# EAGLE design chessexpress (EAGLE 9.5.1)
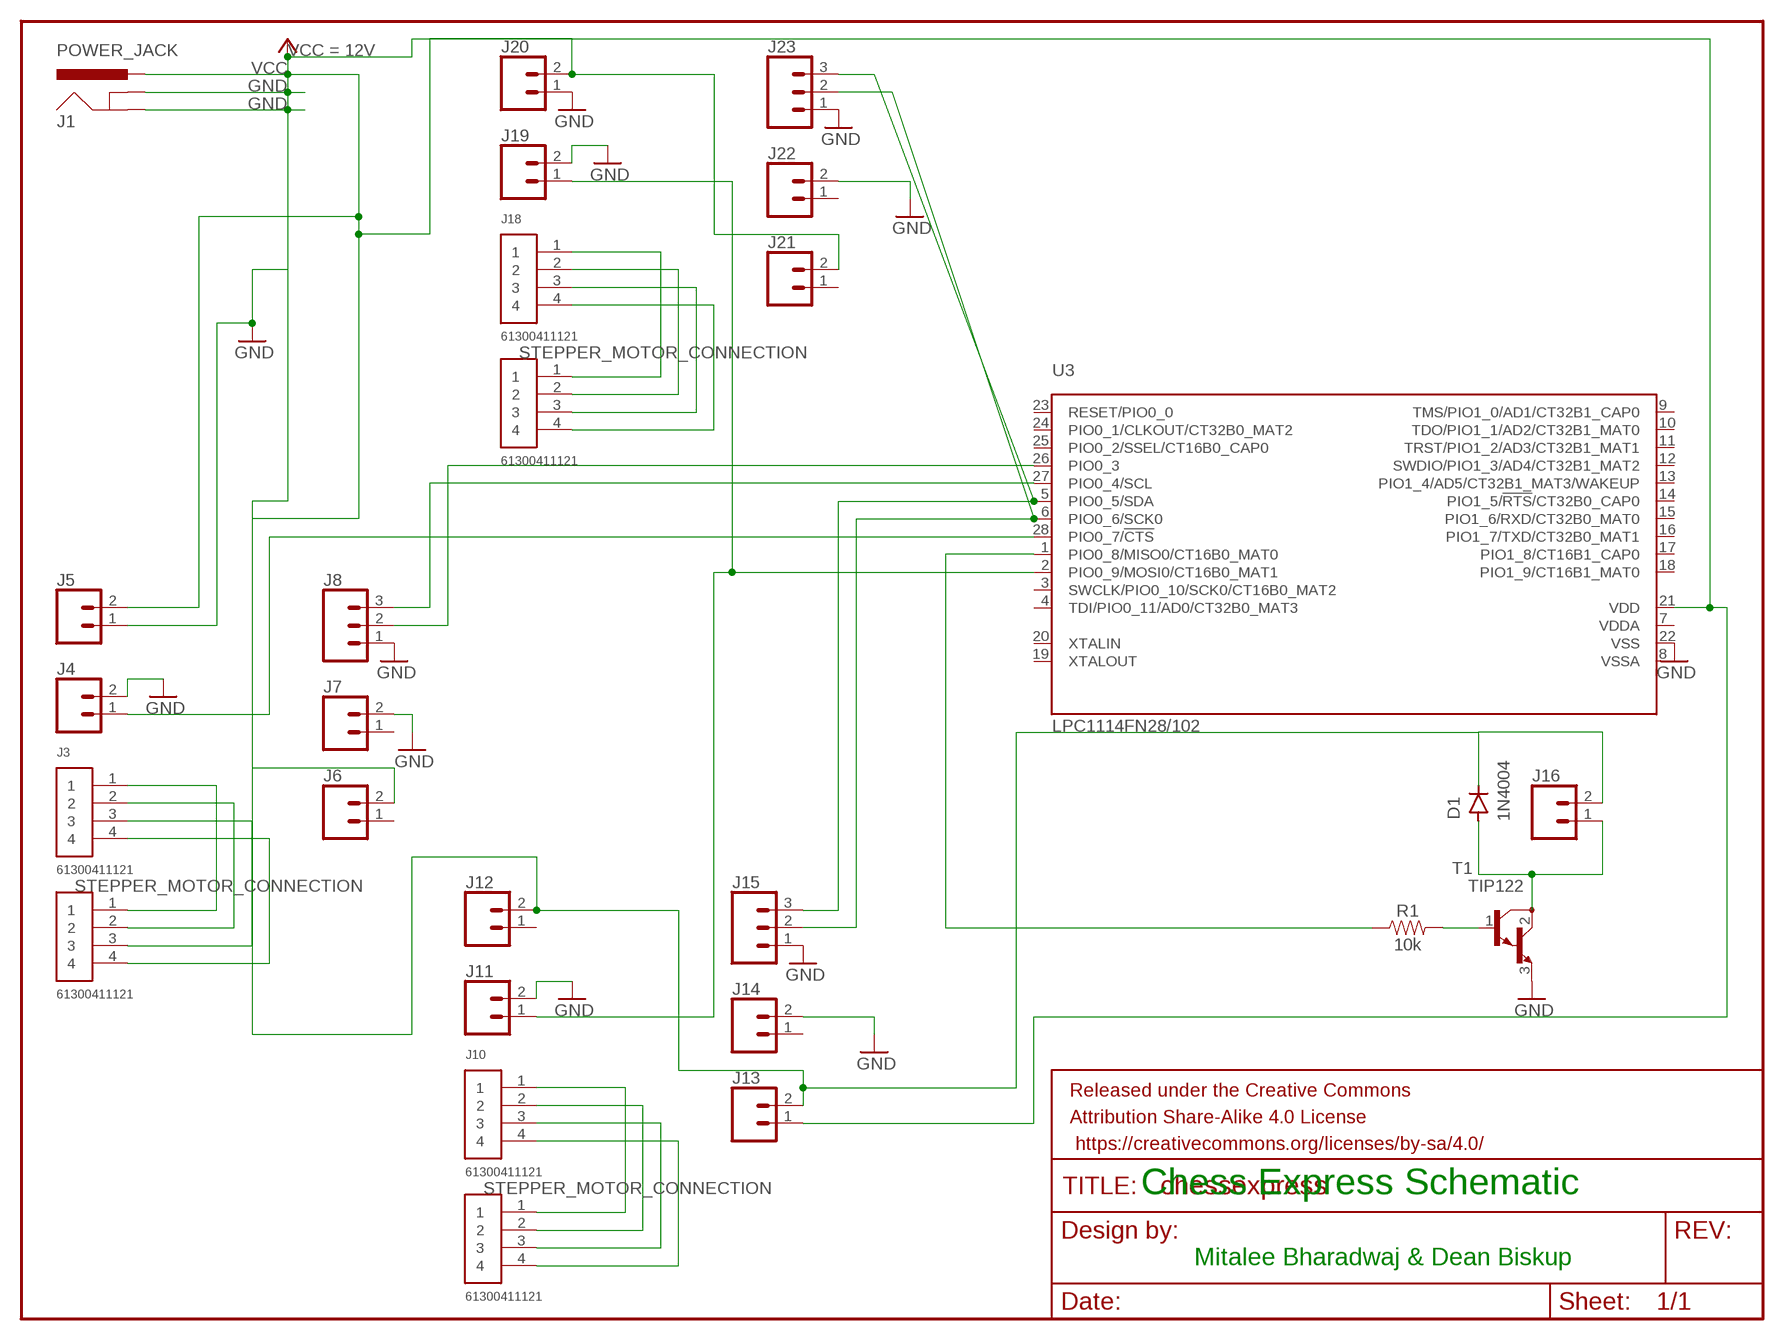
[diagram p0: schematic, sheet 1]

## Parts
D1  1N4004  [DO-41]
FRAME  FRAME-LETTERNO_PACKAGE  [DUMMY]
J1  POWER_JACK  [POWER_JACK_PTH]
J2  61300411121  [61300411121]
J3  61300411121  [61300411121]
J4  CONN_02  [1X02]
J5  CONN_02  [1X02]
J6  CONN_02  [1X02]
J7  CONN_02  [1X02]
J8  CONN_03  [1X03]
J9  61300411121  [61300411121]
J10  61300411121  [61300411121]
J11  CONN_02  [1X02]
J12  CONN_02  [1X02]
J13  CONN_02  [1X02]
J14  CONN_02  [1X02]
J15  CONN_03  [1X03]
J16  CONN_02  [1X02]
J17  61300411121  [61300411121]
J18  61300411121  [61300411121]
J19  CONN_02  [1X02]
J20  CONN_02  [1X02]
J21  CONN_02  [1X02]
J22  CONN_02  [1X02]
J23  CONN_03  [1X03]
R1  10k  10KOHM-0603-1/10W-1%  [0603]
T1  TIP122  [TO220]
U3  LPC1114FN28/102  [SOT117]

## Nets
GND: J1.GND J1.GNDBREAK J4.2 J5.1 J7.2 J8.1 J11.2 J14.2 J15.1 J19.2 J20.1 J22.2 J23.1 T1.3(E) U3.22(VSS)
J2_1: J2.1 J3.1
J2_2: J2.2 J3.2
J2_3: J2.3 J3.3
J2_4: J2.4 J3.4
J2_5: J9.1 J10.1
J2_6: J9.2 J10.2
J2_7: J9.3 J10.3
J2_8: J9.4 J10.4
J2_9: J17.1 J18.1
J2_10: J17.2 J18.2
J2_11: J17.3 J18.3
J2_12: J17.4 J18.4
N$1: J4.1 U3.28(PIO0_7/!CTS!)
N$2: D1.A J16.1 T1.2(C)
N$3: J11.1 J19.1 U3.2(PIO0_9/MOSI0/CT16B0_MAT1)
N$4: J8.3 U3.27(PIO0_4/SCL)
N$5: J8.2 U3.26(PIO0_3)
N$8: R1.1 U3.1(PIO0_8/MISO0/CT16B0_MAT0)
N$9: R1.2 T1.1(B)
N$10: J15.3 J23.3 U3.5(PIO0_5/SDA)
N$11: J15.2 J23.2 U3.6(PIO0_6/SCK0)
VCC: D1.C J1.PWR J5.2 J6.2 J12.2 J13.1 J13.2 J16.2 J20.2 J21.2 U3.21(VDD)
Unconnected: J6.1 J7.1 J12.1 J14.1 J21.1 J22.1 U3.3(SWCLK/PIO0_10/SCK0/CT16B0_MAT2) U3.4(TDI/PIO0_11/AD0/CT32B0_MAT3) U3.9(TMS/PIO1_0/AD1/CT32B1_CAP0) U3.10(TDO/PIO1_1/AD2/CT32B1_MAT0) U3.11(TRST/PIO1_2/AD3/CT32B1_MAT1) U3.12(SWDIO/PIO1_3/AD4/CT32B1_MAT2) U3.13(PIO1_4/AD5/CT32B1_MAT3/WAKEUP) U3.14(PIO1_5/!RTS!/CT32B0_CAP0) U3.15(PIO1_6/RXD/CT32B0_MAT0) U3.16(PIO1_7/TXD/CT32B0_MAT1) U3.17(PIO1_8/CT16B1_CAP0) U3.18(PIO1_9/CT16B1_MAT0) U3.19(XTALOUT) U3.20(XTALIN) U3.23(RESET/PIO0_0) U3.24(PIO0_1/CLKOUT/CT32B0_MAT2) U3.25(PIO0_2/SSEL/CT16B0_CAP0)

## Notes on the sheet
- Chess Express Schematic
- Mitalee Bharadwaj & Dean Biskup

## Power pins joined to a net without a drawn wire
VDDA: U3.7(VDDA)
VSSA: U3.8(VSSA)

## Library data of the parts
D1 = Diodes:1N4004: DIODE GEN PURP 400V 1A DO41 Manufacturer's datasheet <https://www.mccsemi.com/pdf/Products/1N4001-1N4007(DO-41).pdf>; CREATED_BY: PCBLayout.com; DIGIKEY_PART_NUMBER: 1N4004MSCT-ND; MANUFACTURER: Micro Commercial Co; MPN: 1N4004; PACKAGE: DO-41
FRAME = SparkFun-Aesthetics:FRAME-LETTER: Schematic Frame - Letter Standard 8.5x11 US Letter frame; DESIGNER: Nobody; VERSION: v01
J1 = SparkFun-Connectors:POWER_JACK: Power Jack Connector This is the standard 5.5mm barrel jack for power. The PTH is the most common, proven, reliable, footprint. The Slot footprint only works if the mill layer is transmitted to the PCB fab house so be warned. Here are the connectors we sell at SparkFun: DC Barrel Power Jack/Connector <https://www.sparkfun.com/products/119> (PRT-00119) DC Barrel Power Jack/Connector (SMD) <https://www.sparkfun.com/products/12748> (PRT-12748) DC Barrel Jack Adapter - Breadboard Compatible <https://www.sparkfun.com/products/10811> (PRT-10811) It is used on this SparkFun product (and many, many others): SparkFun RedBoard - Programmed with Arduino <https://www.sparkfun.com/products/12757> (DEV-12757) Also, if you need a mating power supply or connector, please check these out: Wall Adapter Power Supply - 9VDC 650mA <https://www.sparkfun.com/products/298> (TOL-00298) DC Barrel Jack Adapter - Male <https://www.sparkfun.com/products/10287> (PRT-10287); PROD_ID: CONN-08197
J2 J9 J17 = Headers:61300411121: CONN HEADER VERT 4POS 2.54MM Manufacturer's datasheet <https://katalog.we-online.de/em/datasheet/6130xx11121.pdf>; CREATED_BY: PCBLayout.com; DIGI_KEY_PART_NUMBER: 732-5317-ND; FEMALE_HEADER: STEPPER_MOTOR_CONNECTION; MANUFACTURER: Wurth Electronics Inc.; MPN: 61300411121
J3 J10 J18 = Headers:61300411121: CONN HEADER VERT 4POS 2.54MM Manufacturer's datasheet <https://katalog.we-online.de/em/datasheet/6130xx11121.pdf>; CREATED_BY: PCBLayout.com; DIGI_KEY_PART_NUMBER: 732-5317-ND; MANUFACTURER: Wurth Electronics Inc.; MPN: 61300411121
J4-J7 J11-J14 J16 J19-J22 = SparkFun-Connectors:CONN_02: Multi connection point. Often used as Generic Header-pin footprint for 0.1 inch spaced/style header connections On any of the 0.1 inch spaced packages, you can populate with these: Break Away Headers - Straight <https://www.sparkfun.com/products/116> (PRT-00116) Break Away Male Headers - Right Angle <https://www.sparkfun.com/products/553> (PRT-00553) Female Headers <https://www.sparkfun.com/products/115> (PRT-00115) Break Away Headers - Machine Pin <https://www.sparkfun.com/products/117> (PRT-00117) Break Away Female Headers - Swiss Machine Pin <https://www.sparkfun.com/products/743> (PRT-00743) For SCREWTERMINALS and SPRING TERMINALS visit here: Screw Terimnals on SparkFun.com <https://www.sparkfun.com/search/results?term=Screw+Terminals> (5mm/3.5mm/2.54mm spacing) This device is also useful as a general connection point to wire up your design to another part of your project. Our various solder wires solder well into these plated through hole pads. Hook-Up Wire - Assortment (Stranded, 22 AWG) <https://www.sparkfun.com/products/11375> (PRT-11375) Hook-Up Wire - Assortment (Solid Core, 22 AWG) <https://www.sparkfun.com/products/11367> (PRT-11367) View the entire wire category on our website here <https://www.sparkfun.com/categories/141> Special notes: Molex polarized connector foot print use with: PRT-08233 with associated crimp pins and housings. 2.54_SCREWTERM for use with PRT-10571. 3.5mm Screw Terminal footprints for PRT-08084 5mm Screw Terminal footprints for use with PRT-08432
J8 J15 J23 = SparkFun-Connectors:CONN_03: Multi connection point. Often used as Generic Header-pin footprint for 0.1 inch spaced/style header connections On any of the 0.1 inch spaced packages, you can populate with these: Break Away Headers - Straight <https://www.sparkfun.com/products/116> (PRT-00116) Break Away Male Headers - Right Angle <https://www.sparkfun.com/products/553> (PRT-00553) Female Headers <https://www.sparkfun.com/products/115> (PRT-00115) Break Away Headers - Machine Pin <https://www.sparkfun.com/products/117> (PRT-00117) Break Away Female Headers - Swiss Machine Pin <https://www.sparkfun.com/products/743> (PRT-00743) Stackable Header - 3 Pin (Female, 0.1") <https://www.sparkfun.com/products/13875> (PRT-13875) For SCREWTERMINALS and SPRING TERMINALS visit here: Screw Terimnals on SparkFun.com <https://www.sparkfun.com/search/results?term=Screw+Terminals> (5mm/3.5mm/2.54mm spacing) This device is also useful as a general connection point to wire up your design to another part of your project. Our various solder wires solder well into these plated through hole pads. Hook-Up Wire - Assortment (Stranded, 22 AWG) <https://www.sparkfun.com/products/11375> (PRT-11375) Hook-Up Wire - Assortment (Solid Core, 22 AWG) <https://www.sparkfun.com/products/11367> (PRT-11367) View the entire wire category on our website here <https://www.sparkfun.com/categories/141> Special notes: Molex polarized connector foot print use with SKU : PRT-08232 with associated crimp pins and housings.
R1 = SparkFun-Resistors:10KOHM: 10kΩ resistor A resistor is a passive two-terminal electrical component that implements electrical resistance as a circuit element. Resistors act to reduce current flow, and, at the same time, act to lower voltage levels within circuits. - Wikipedia; PROD_ID: RES-00824
T1 = transistor:TIP122: NPN BIPOLAR DARLINGTON TRANSISTOR
U3 = nxp_60_1_1:LPC1114FN28: 32-bit ARM Cortex-M0 microcontroller; up to 64 kB flash and 8 kB SRAM The LPC1110/11/12/13/14/15 are a ARM Cortex-M0 based, low-cost 32-bit MCU family, designed for 8/16-bit microcontroller applications, offering performance, low power, simple instruction set and memory addressing together with reduced code size compared to existing 8/16-bit architectures. The LPC1110/11/12/13/14/15 operate at CPU frequencies of up to 50 MHz. The peripheral complement of the LPC1110/11/12/13/14/15 includes up to 64 kB of flash memory, up to 8 kB of data memory, one Fast-mode Plus I 2 C-bus interface, one RS-485/EIA-485 UART, up to two SPI interfaces with SSP features, four general purpose counter/timers, a 10-bit ADC, and up to 42 general purpose I/O pins. Remark: The LPC111x series consists of the LPC1100 series (parts LPC111x/101/201/301), LPC1100L series (parts LPC111x/002/102/202/302), and the LPC1100XL series (parts LPC111x/103/203/303/323/333). The LPC1100L and LPC1100XL series include the power profiles, a windowed watchdog timer, and a configurable open-drain mode. AAL Eindhoven MK; ADC: 6; FLASH: 32kB; GPIO: 22; PWR_PROFILES: yes; SERIES: LPC1100L; SPI: 1; SRAM: 4kB

## Board
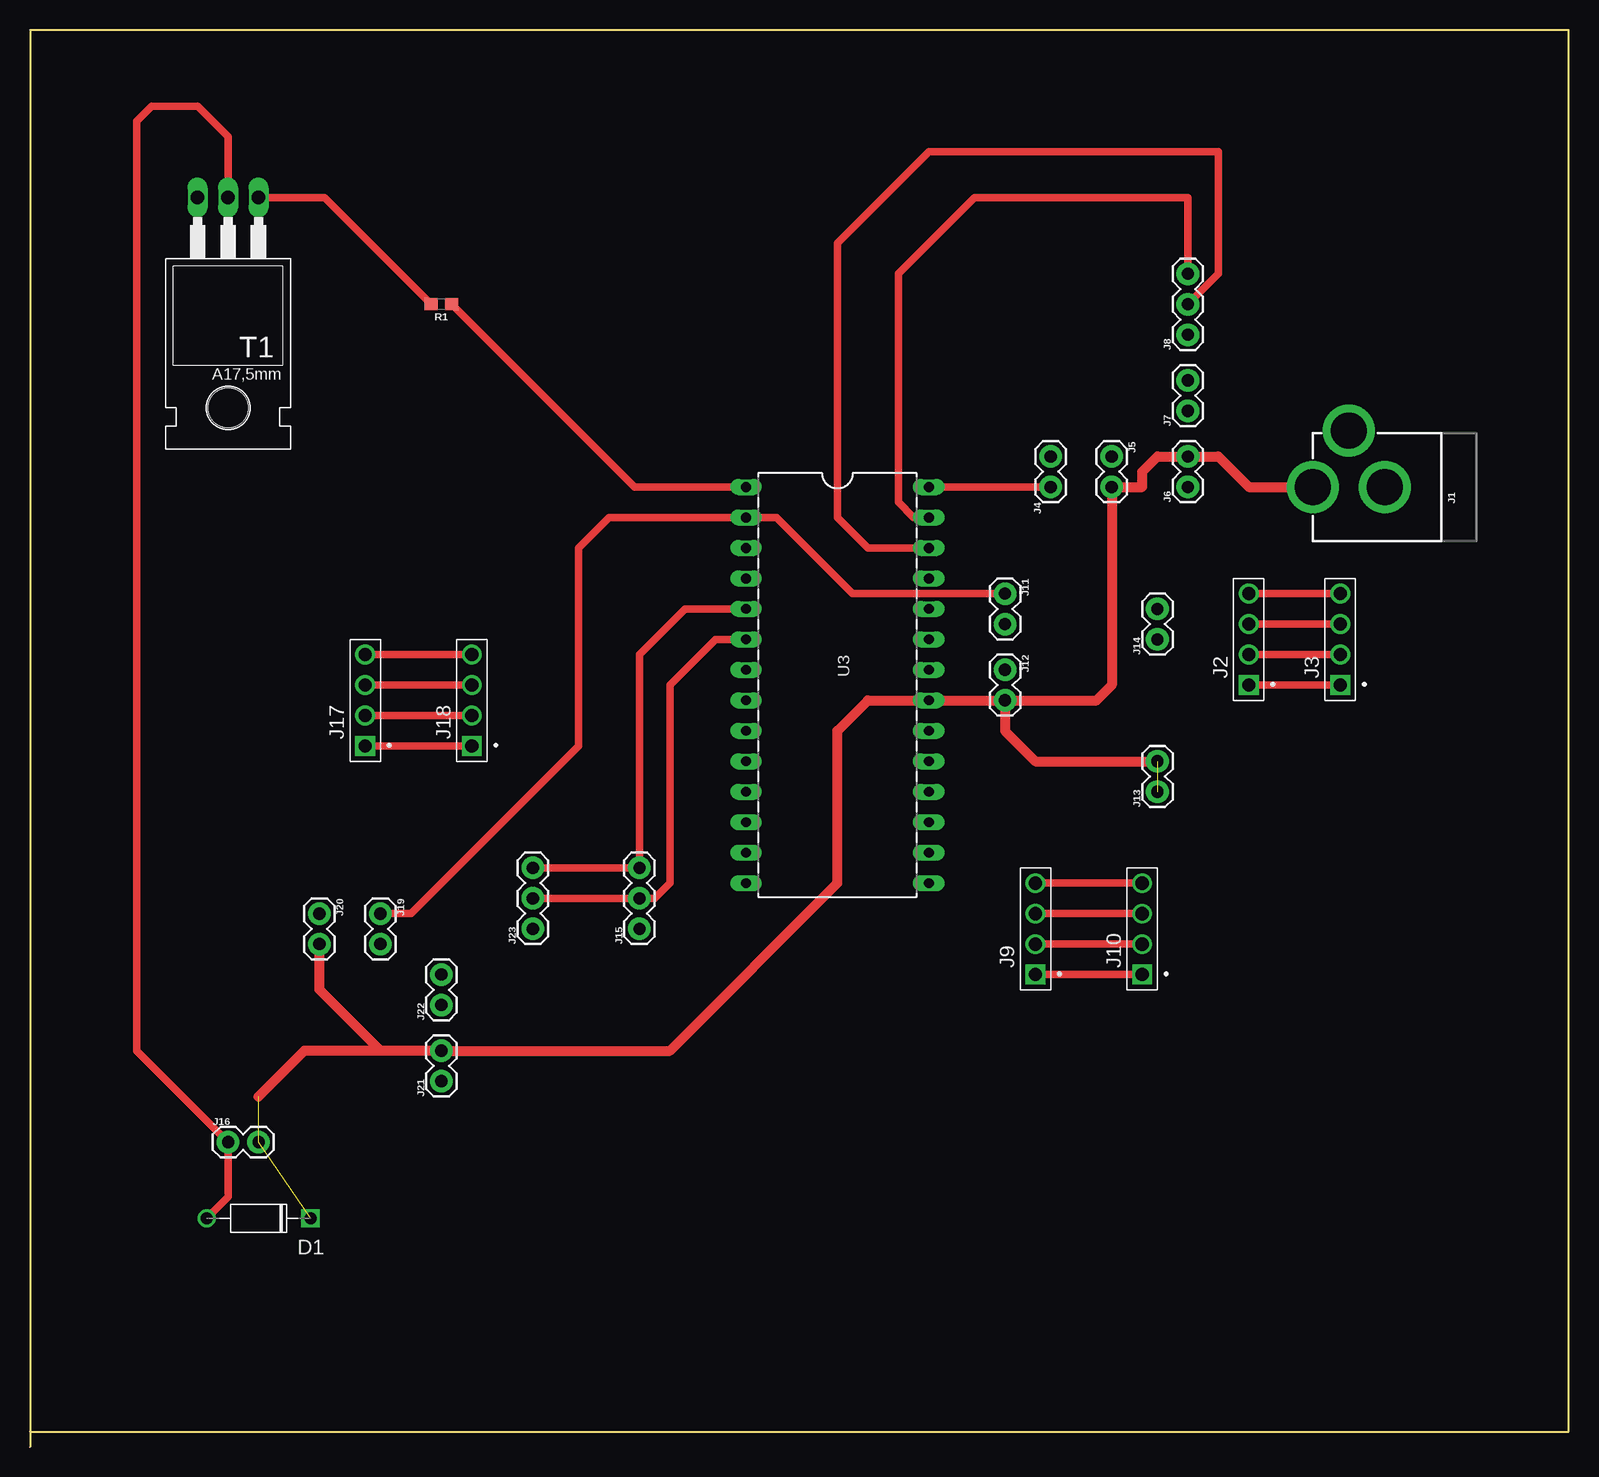
[diagram p1: board, top side]
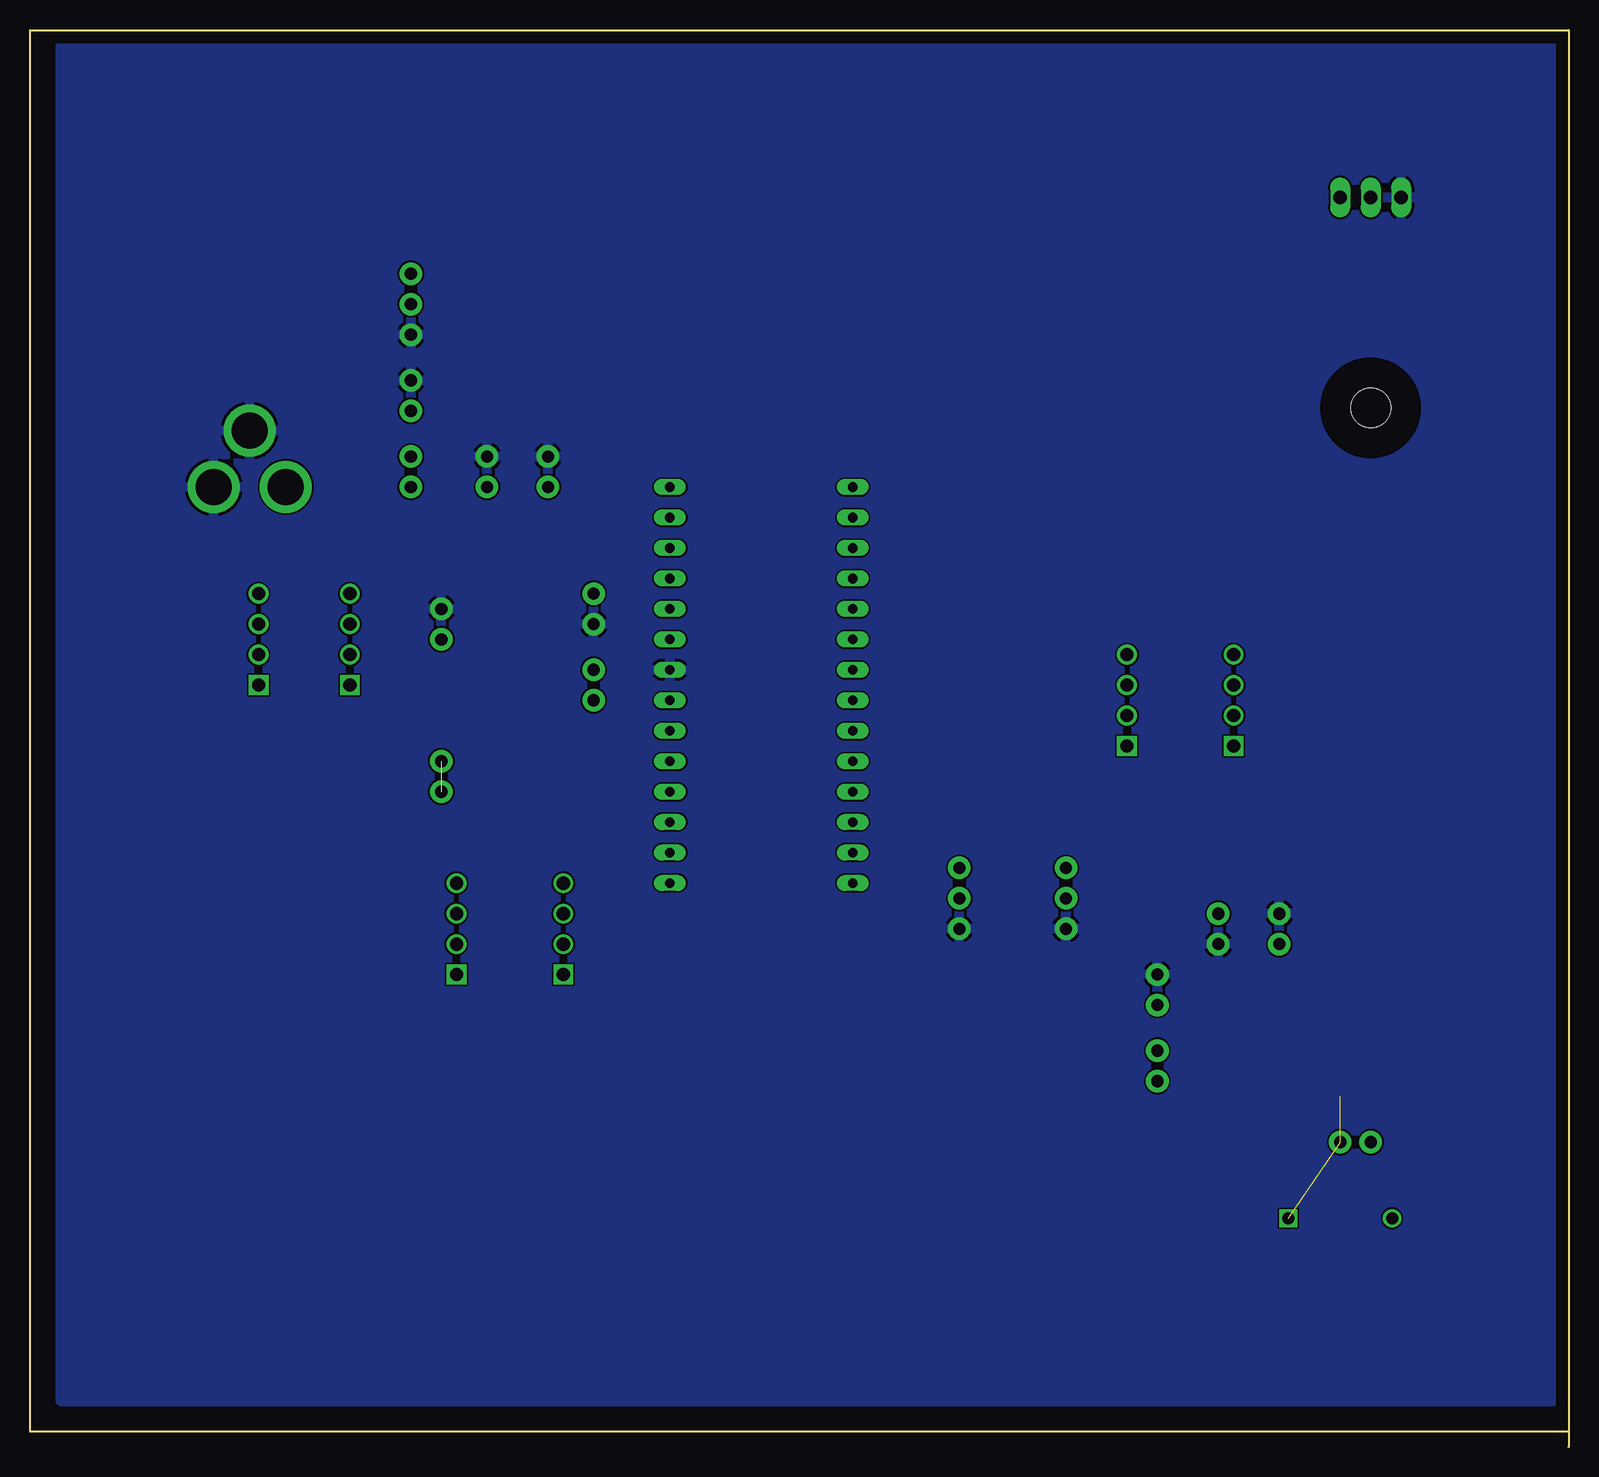
[diagram p2: board, bottom side, seen from below]

Size 128.27 x 118.11 mm. Coordinates in mm from the lower left corner, seen from the top.
Outline: 0,1.27 128.27,1.27 128.27,118.11 0,118.11 0,0
Copper layers (1*16): Top 0.035mm / dielectric 1.5mm / Bottom 0.035mm
Design rules "default": minimum track width 6mil, minimum drill 0.35mm, track to track 6mil, track to pad 6mil, pad to pad 6mil, via to via 6mil, smd to smd 6mil, copper to edge 40mil, drill to drill 6mil, minimum pad ring 10mil, minimum via ring 8mil, stop-mask expansion 4mil, vias tented up to drill 0mil, thermal gap 10mil

### Footprints (pad centres in the part's own frame; a part is rotated, then mirrored left to right if it is on the bottom)
DO-41 = drill 1: A 4.325,0 | drill 1 square: C -4.325,0
POWER_JACK_PTH = drill 2.997 pad 4.318: GND 0,7.7; GNDBREAK 4.7,10.7; PWR 0,13.7
61300411121 = drill 1.1 square: 1 -3.81,0 | drill 1.1: 2 -1.27,0; 3 1.27,0; 4 3.81,0
1X02 = drill 1.016 pad 1.88: 1 0,0; 2 2.54,0
1X03 = drill 1.016 pad 1.88: 1 0,0; 2 2.54,0; 3 5.08,0
0603 = smd 1.1 x 1: 1 -0.85,0; 2 0.85,0
TO220 = drill 1.118 long: 1 -2.54,-6.35; 2 0,-6.35; 3 2.54,-6.35 | hole 3.302: 0,11.176
SOT117 = drill 0.813 long: 1 -16.51,-7.62; 2 -13.97,-7.62; 3 -11.43,-7.62; 4 -8.89,-7.62; 5 -6.35,-7.62; 6 -3.81,-7.62; 7 -1.27,-7.62; 8 1.27,-7.62; 9 3.81,-7.62; 10 6.35,-7.62; 11 8.89,-7.62; 12 11.43,-7.62; 13 13.97,-7.62; 14 16.51,-7.62; 15 16.51,7.62; 16 13.97,7.62; 17 11.43,7.62; 18 8.89,7.62; 19 6.35,7.62; 20 3.81,7.62; 21 1.27,7.62; 22 -1.27,7.62; 23 -3.81,7.62; 24 -6.35,7.62; 25 -8.89,7.62; 26 -11.43,7.62; 27 -13.97,7.62; 28 -16.51,7.62

### Placement (x,y rotation side)
D1  19.05,19.05 180 top
FRAME  0,1.27 180 top
J1  120.65,80.01 90 top
J2  101.6,67.31 90 top
J3  109.22,67.31 90 top
J4  85.09,80.01 90 top
J5  90.17,82.55 270 top
J6  96.52,80.01 90 top
J7  96.52,86.36 90 top
J8  96.52,92.71 90 top
J9  83.82,43.18 90 top
J10  92.71,43.18 90 top
J11  81.28,71.12 270 top
J12  81.28,64.77 270 top
J13  93.98,54.61 90 top
J14  93.98,67.31 90 top
J15  50.8,43.18 90 top
J16  16.51,25.4 0 top
J17  27.94,62.23 90 top
J18  36.83,62.23 90 top
J19  29.21,44.45 270 top
J20  24.13,44.45 270 top
J21  34.29,30.48 90 top
J22  34.29,36.83 90 top
J23  41.91,43.18 90 top
R1  34.29,95.25 180 top
T1  16.51,97.79 180 top
U3  67.31,63.5 270 top

### Tracks (layer width: path | path; a pad name or v marks a point on that pad's centre or on a via)
GND
  pour Bottom: 1.27,116.84 125.73,116.84 125.73,3.81 1.27,3.81
J2_1
  Top 0.61: J3.1 J2.1
J2_2
  Top 0.61: J3.2 J2.2
J2_3
  Top 0.61: J3.3 J2.3
J2_4
  Top 0.61: J3.4 J2.4
J2_5
  Top 0.61: J9.1 J10.1
J2_6
  Top 0.61: J9.2 J10.2
J2_7
  Top 0.61: J9.3 J10.3
J2_8
  Top 0.61: J9.4 J10.4
J2_9
  Top 0.61: J17.1 J18.1
J2_10
  Top 0.61: J18.2 J17.2
J2_11
  Top 0.61: J17.3 J18.3
J2_12
  Top 0.61: J17.4 J18.4
N$1
  Top 0.61: U3.28 J4.1
N$2
  Top 0.61: T1.2 16.51,109.22 13.97,111.76 10.16,111.76 8.89,110.49 8.89,33.02 J16.1 16.51,20.84 D1.A
N$3
  Top 0.61: J19.1 31.75,44.45 45.72,58.42 45.72,74.93 48.26,77.47 U3.2 62.23,77.47 68.58,71.12 J11.1
N$4
  Top 0.61: J8.3 96.52,104.14 78.74,104.14 72.39,97.79 72.39,78.74 73.66,77.47 U3.27
N$5
  Top 0.61: J8.2 99.06,97.79 99.06,107.95 74.93,107.95 67.31,100.33 67.31,77.47 69.85,74.93 U3.26
N$8
  Top 0.61: U3.1 50.38,80.01 R1.1
N$9
  Top 0.61: 33.02,95.67 R1.2 24.55,104.14 T1.1
N$10
  Top 0.61: J23.3 J15.3 50.8,66.04 54.61,69.85 U3.5
N$11
  Top 0.61: J23.2 J15.2 52.07,45.72 53.34,46.99 53.34,63.5 57.15,67.31 U3.6
VCC  (3 unrouted)
  Top 0.813: J1.PWR 101.6,80.01 99.06,82.55 J6.2 93.98,82.55 92.71,81.28 92.71,80.01 J5.2 90.17,63.5 88.9,62.23 J12.2 | J12.2 81.28,59.69 83.82,57.15 J13.2 | J21.2 53.34,33.02 67.31,46.99 67.31,59.69 69.85,62.23 U3.21 J12.2 | J21.2 29.21,33.02 24.13,38.1 J20.2 | J21.2 22.86,33.02 19.05,29.21